# Altium schematic sheet edison.SchDoc
size A4
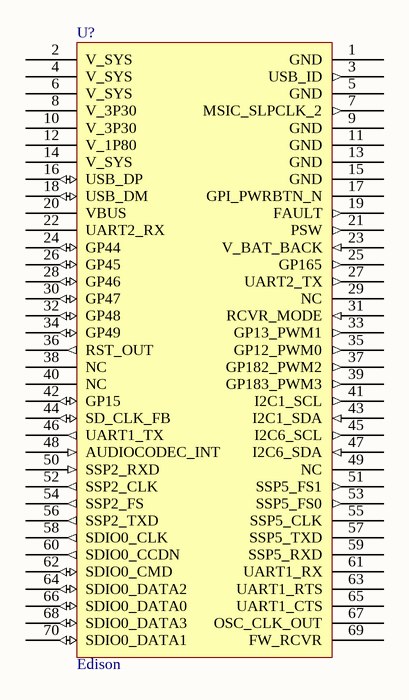
[diagram p0: edison.SchDoc]

## Parts
U?  Edison

## Nets

Not connected (* = marked no-connect by the designer): U? 1(GND) 2(V_SYS) 3(USB_ID) 4(V_SYS) 5(GND) 6(V_SYS) 7(MSIC_SLPCLK_2) 8(V_3P30) 9(GND) 10(V_3P30) 11(GND) 12(V_1P80) 13(GND) 14(V_SYS) 15(GND) 16(USB_DP) 17(GPI_PWRBTN_N) 18(USB_DM) 19(FAULT) 20(VBUS) 21(PSW) 22(UART2_RX) 23(V_BAT_BACK) 24(GP44) 25(GP165) 26(GP45) 27(UART2_TX) 28(GP46) 29(NC) 30(GP47) 31(RCVR_MODE) 32(GP48) 33(GP13_PWM1) 34(GP49) 35(GP12_PWM0) 36(RST_OUT) 37(GP182_PWM2) 38(NC) 39(GP183_PWM3) 40(NC) 41(I2C1_SCL) 42(GP15) 43(I2C1_SDA) 44(SD_CLK_FB) 45(I2C6_SCL) 46(UART1_TX) 47(I2C6_SDA) 48(AUDIOCODEC_INT) 49(NC) 50(SSP2_RXD) 51(SSP5_FS1) 52(SSP2_CLK) 53(SSP5_FS0) 54(SSP2_FS) 55(SSP5_CLK) 56(SSP2_TXD) 57(SSP5_TXD) 58(SDIO0_CLK) 59(SSP5_RXD) 60(SDIO0_CCDN) 61(UART1_RX) 62(SDIO0_CMD) 63(UART1_RTS) 64(SDIO0_DATA2) 65(UART1_CTS) 66(SDIO0_DATA0) 67(OSC_CLK_OUT) 68(SDIO0_DATA3) 69(FW_RCVR) 70(SDIO0_DATA1)